# EAGLE schematic switch_module (EAGLE 9.2.2)
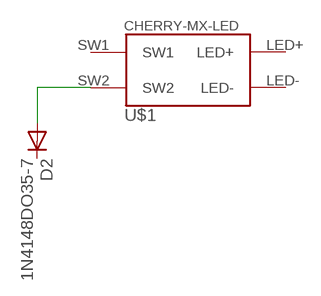
[diagram p0: schematic, sheet 1]

## Parts
D2  1N4148DO35-7  [DO35-7]
U$1  CHERRY-MX-LED  [CHERRY-MX-LED]

## Nets
N$1: D2.A U$1.SW2
Unconnected: D2.C U$1.LED+ U$1.LED- U$1.SW1

## Library data of the parts
D2 = diode:1N4148: DIODE high speed (Philips)
U$1 = cherrymx:CHERRY-MX-LED: Cherry MX series keyswitch with LED